# EAGLE design 2_pow_input (EAGLE 6.4)
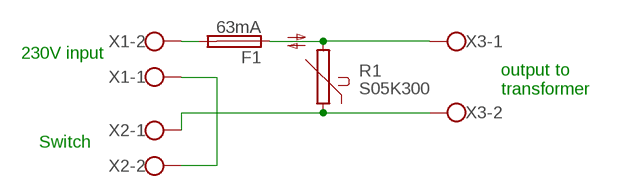
[diagram p0: schematic, sheet 1]

## Parts
F1  63mA  SH22,5A  [SH22,5A]
R1  S05K300  [S05K300]
X1  W237-02P  [W237-132]
X2  W237-02P  [W237-132]
X3  W237-02P  [W237-132]

## Nets
N$5: F1.2 X1.2
N$6: R1.1 X2.1 X3.2
N$7: F1.1 R1.2 X3.1
N$8: X1.1 X2.2

## Notes on the sheet
- 230V input
- output to 
  transformer
- Switch

## Library data of the parts
F1 = fuse:SH22,5A: FUSE HOLDER grid 22,5mm, isolated cap OGN0031 8201, Schurter (Buerklin)
R1 = varistor:S05K300: VARISTOR
X1-X3 = con-wago-508:W237-02P: WAGO SREW CLAMP

## Board
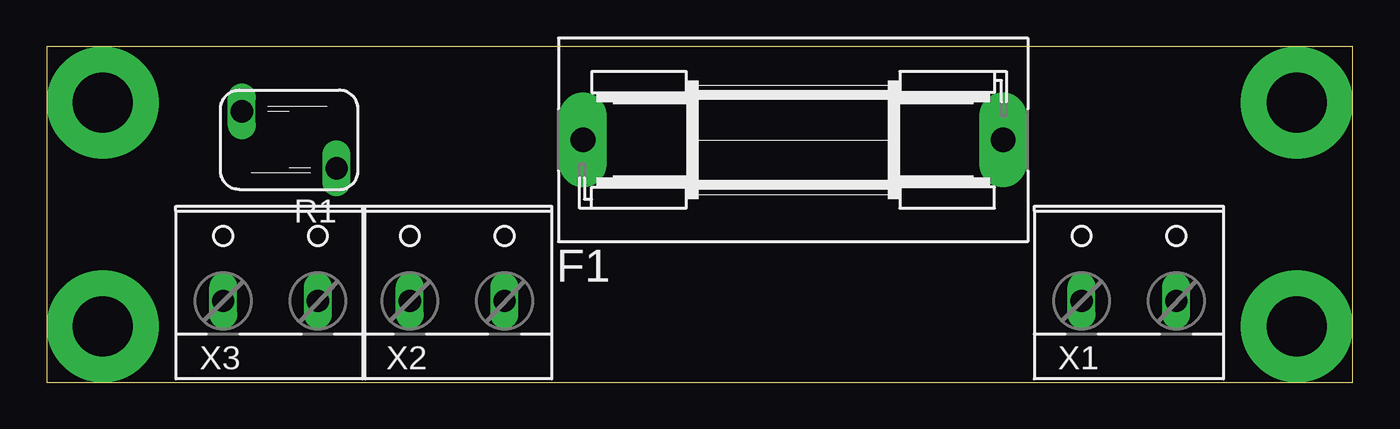
[diagram p1: board, top side]
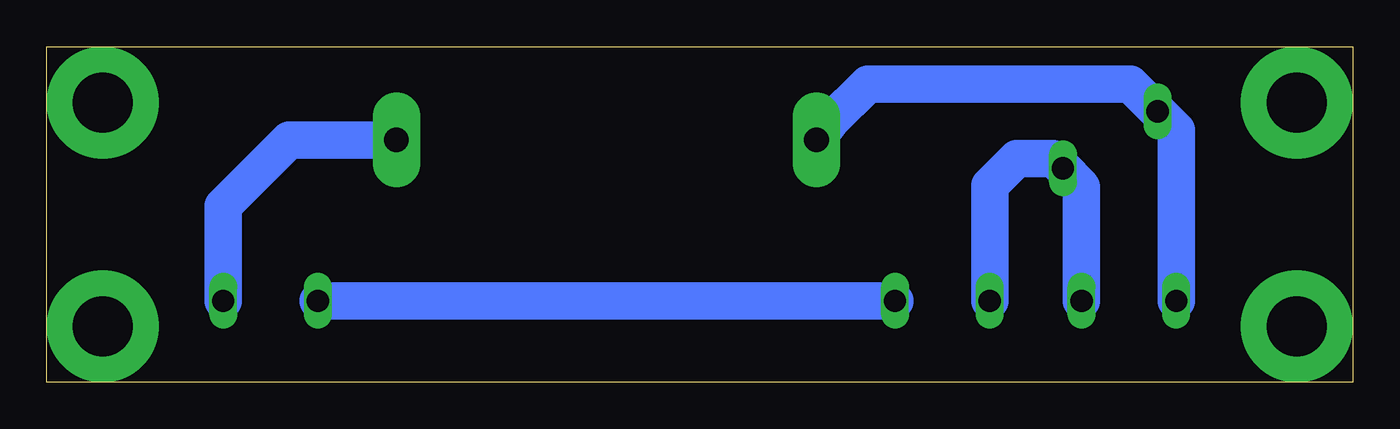
[diagram p2: board, bottom side, seen from below]

Size 70 x 18 mm. Coordinates in mm from the lower left corner, seen from the top.
Outline: 0,0 70,0 70,18 0,18 0,0
Copper layers (1*16): Top 0.035mm / dielectric 1.5mm / Bottom 0.035mm
Design rules "ch_6": minimum track width 0.15mm, minimum drill 0.4mm, track to track 0.2mm, track to pad 0.2mm, pad to pad 0.2mm, via to via 0.2mm, smd to smd 0.2mm, copper to edge 0.6mm, drill to drill 8mil, minimum pad ring 0.15mm, minimum via ring 0.15mm, stop-mask expansion 4mil, vias tented up to drill 0mil, thermal gap 10mil

### Footprints (pad centres in the part's own frame; a part is rotated, then mirrored left to right if it is on the bottom)
SH22,5A = drill 1.321 pad 2.54 long: 1 -11.252,0; 2 11.252,0
S05K300 = drill 1.2 long: 1 -1.524,-2.54; 2 1.524,2.54
W237-132 = drill 1.194 long: 1 -2.54,-0.635; 2 2.54,-0.635

### Placement (x,y rotation side)
F1  40,13 0 top
R1  13,13 90 top
X1  58,5 0 top
X2  22,5 0 top
X3  12,5 0 top

### Tracks (layer width: path | path; a pad name or v marks a point on that pad's centre or on a via)
N$1  (via drill 3.2 pad 6)
  other vias: 3,3
N$2  (via drill 3.2 pad 6)
  other vias: 3,15
N$3  (via drill 3.2 pad 6)
  other vias: 67,15
N$4  (via drill 3.2 pad 6)
  other vias: 67,3
N$5
  Bottom 2: X1.2 60.54,9.46 57,13 F1.2
N$6
  Bottom 2: X2.1 19.46,10.54 18,12 16.06,12 R1.1 14.54,10.48 X3.2
N$7
  Bottom 2: F1.1 28,14 26,16 11.94,16 R1.2 9.46,13.52 X3.1
N$8
  Bottom 2: X2.2 X1.1